# Altium project ArcadeMVD-STM 01-1.5.PrjPCB (part 2 of 2)

## Sheet ArcadeMVD-STM 01-1.5 alternative parts.SchDoc: alternative parts
size A3; DrawnBy: Steve Hodges; DocumentNumber: 2; Revision: 1.5; SheetNumber: 2; SheetTotal: 2
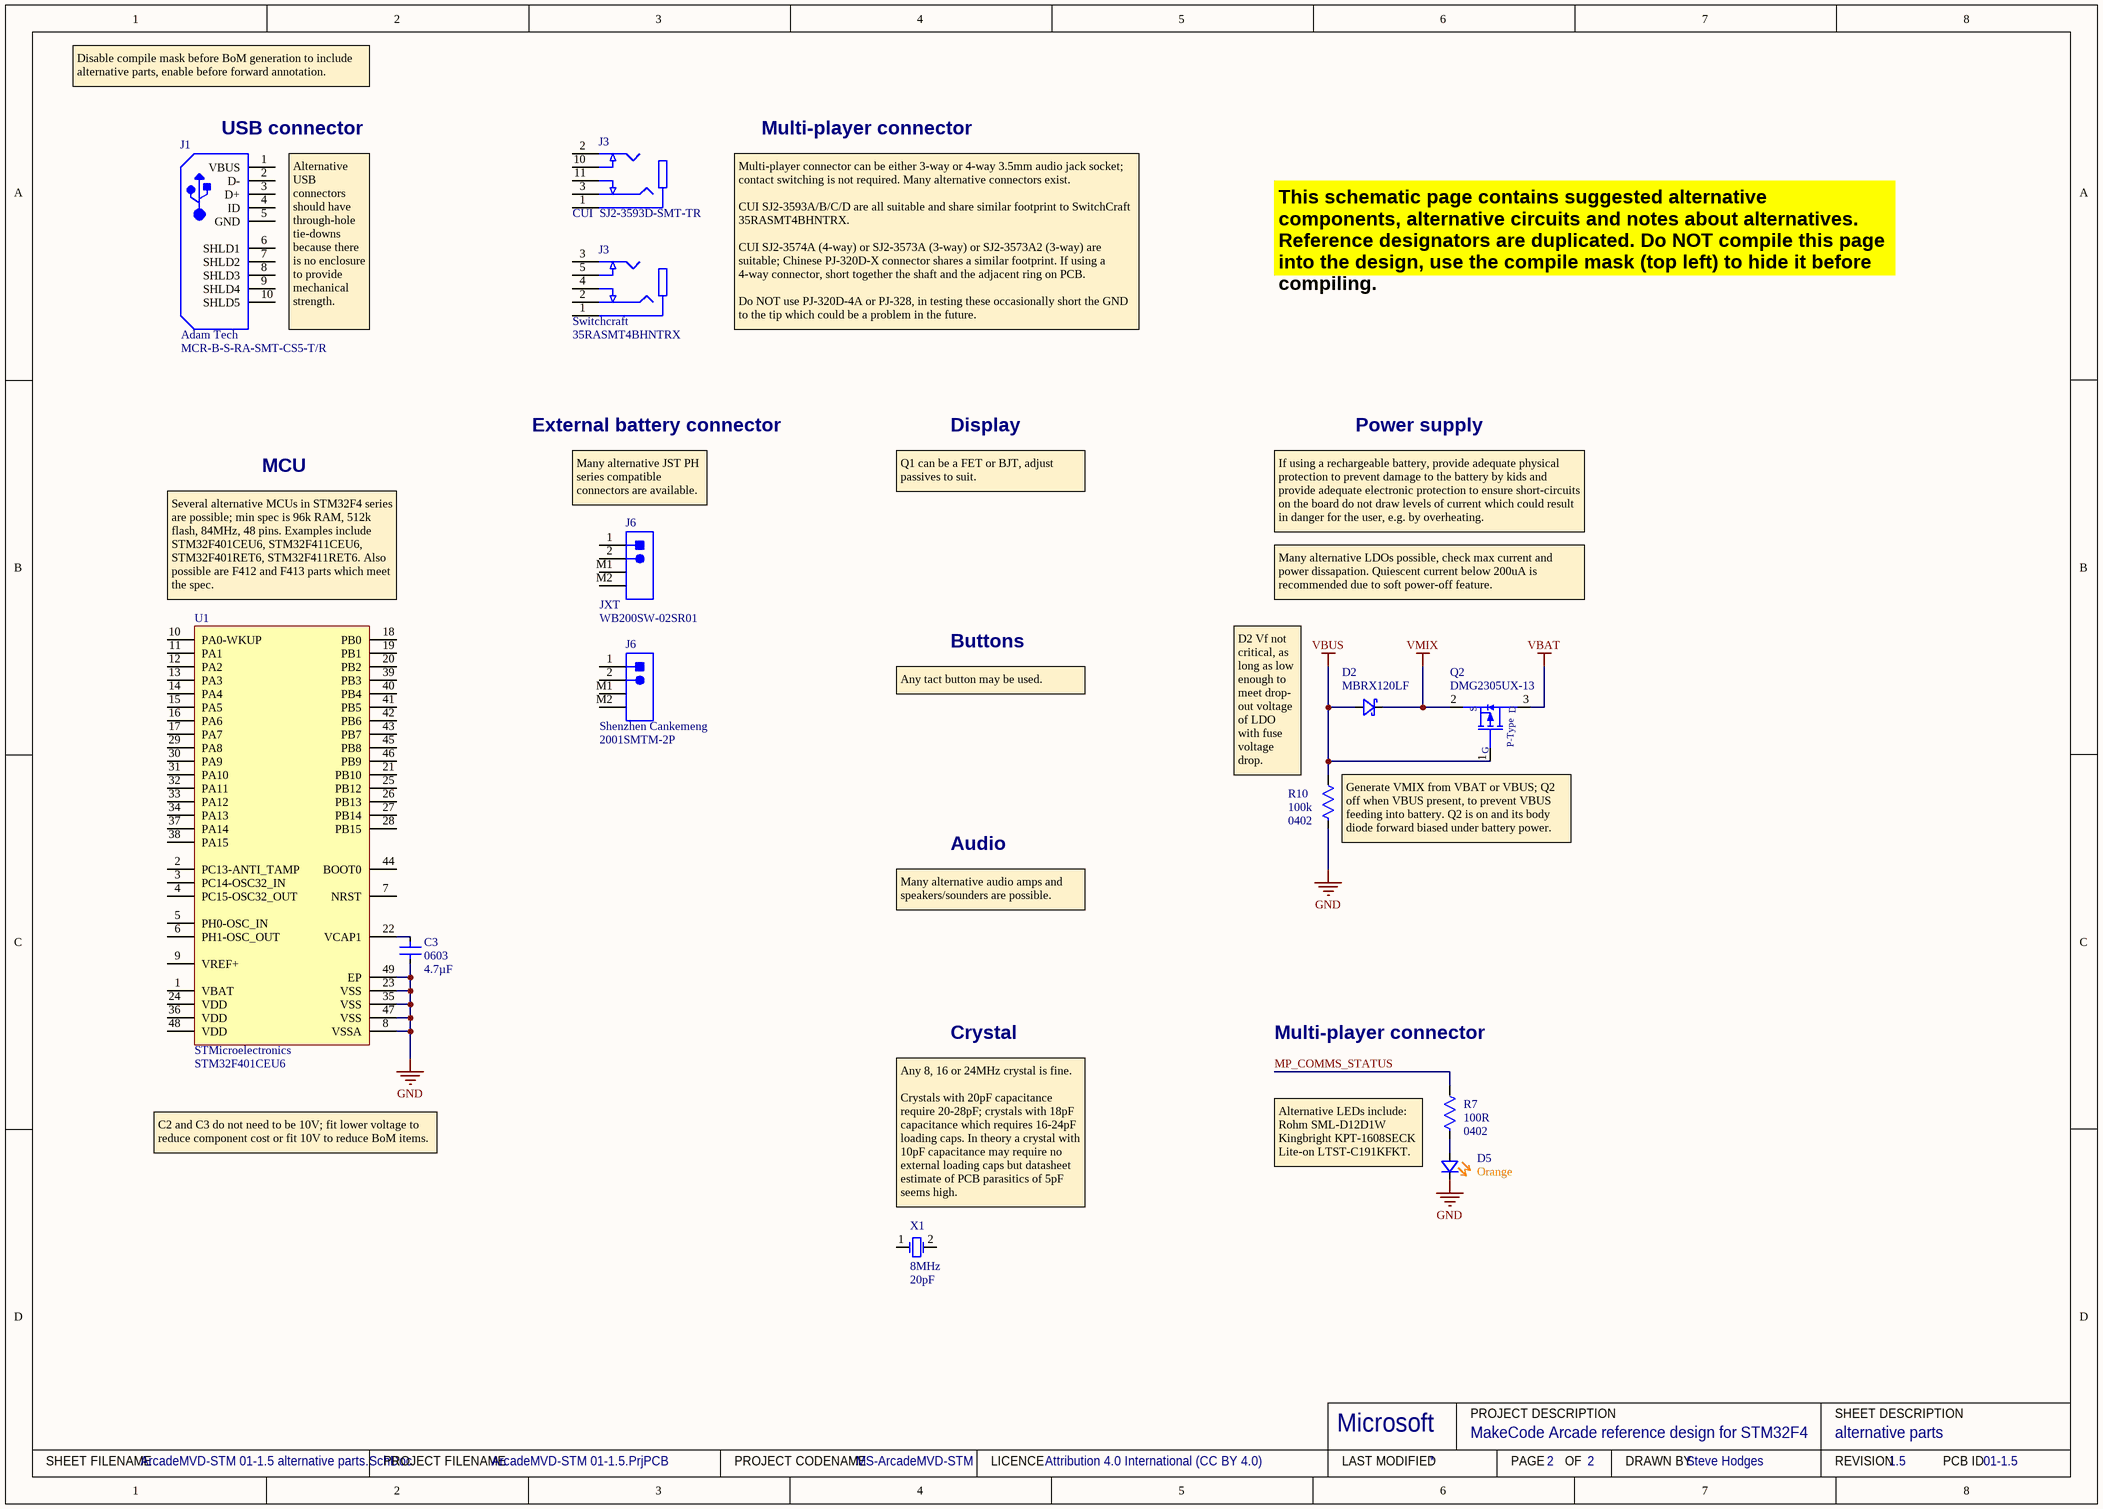
[diagram p1: ArcadeMVD-STM 01-1.5 alternative parts.SchDoc]

### Parts
(Parts that share a designator on the sheet are numbered #1, #2 ... from top to bottom, then left to right.)
C3#2  Case/Package: 0603  Capacitance: 4.7µF  [CAP 0603 (1608) x 1.2mm]  (hidden comment: CL10A475KP8NNNC)  (no BOM)
D2#2  MBRX120LF  [MCC SOD-123]
D5#2  Colour: Orange  [Rohm SML-D12 Orange]  (hidden comment: SML-D12D)  (no BOM)
J1#2  Manufacturer: Adam Tech  [MCR-B-S-RA-SMT-CS5-T/R]  (hidden comment: MCR-B-S-RA-SMT-CS5-T/R)
J3#2  Manufacturer: CUI  Manufacturer Part Number: SJ2-3593D-SMT-TR  [SJ-3593D-SMT-TR]  (hidden comment: SJ2-3593D-SMT)
J3#3  Manufacturer: Switchcraft  [SWIT-35RASMT4BHNTRX_V]  (hidden comment: 35RASMT4BHNTRX)
J6#2  Manufacturer: JXT  [JST- S2B-PH-SM4-TB(LF)(SN)-2_V]  (hidden comment: compatible with S2B-PH-SM4-TB(LF)(SN))
J6#3  Manufacturer: Shenzhen Cankemeng  [JST- S2B-PH-SM4-TB(LF)(SN)-2_V]  (hidden comment: compatible with JST S2B-PH-SM4-TB(LF)(SN))
Q2#2  Manufacturer Part Number: DMG2305UX-13  [DIODES-SOT23-3]  (hidden comment: MOSFET)  (no BOM)
R7#2  value 100R  Case: 0402  [RES0402]  (no BOM)
R10#2  value 100k  Case: 0402  [RES0402]  (hidden comment: RES0402_GENERIC 100k)  (no BOM)
U1#2  Manufacturer: STMicroelectronics  Manufacturer Part Number: STM32F401CEU6  [ST UFQFPN48 SEH]  (hidden comment: ST STM32F401CEU6)
X1#2  Frequency: 8MHz  Load Capacitance: 20pF  [FOX-HC49SDLF_V]  (hidden comment: HX49 SMT xtal 8MHz 20pF)

### Nets
GND: C3#2.1 D5#2.1(K) R10#2.2 U1#2.8(VSSA) U1#2.23(VSS) U1#2.35(VSS) U1#2.47(VSS) U1#2.49(EP)
VBAT: Q2#2.3(D)
VBUS: D2#2.2(A) Q2#2.1(G) R10#2.1
VMIX: D2#2.1(K) Q2#2.2(S)
MP_COMMS_STATUS: R7#2.1
NetC3#2_2: C3#2.2 U1#2.22(VCAP1)
NetD5#2_2: D5#2.2(A) R7#2.2

Not connected (* = marked no-connect by the designer): J1#2 1(VBUS) 2(D-) 3(D+) 4(ID) 5(GND) 6(SHLD1) 7(SHLD2) 8(SHLD3) 9(SHLD4) 10(SHLD5); J3#2 1 2 3 10 11; J3#3 1 2 3 4 5; J6#2 1 2 M1 M2; J6#3 1 2 M1 M2; U1#2 1(VBAT) 2(PC13-ANTI_TAMP) 3(PC14-OSC32_IN) 4(PC15-OSC32_OUT) 5(PH0-OSC_IN) 6(PH1-OSC_OUT) 7(NRST) 9(VREF+) 10(PA0-WKUP) 11(PA1) 12(PA2) 13(PA3) 14(PA4) 15(PA5) 16(PA6) 17(PA7) 18(PB0) 19(PB1) 20(PB2) 21(PB10) 24(VDD) 25(PB12) 26(PB13) 27(PB14) 28(PB15) 29(PA8) 30(PA9) 31(PA10) 32(PA11) 33(PA12) 34(PA13) 36(VDD) 37(PA14) 38(PA15) 39(PB3) 40(PB4) 41(PB5) 42(PB6) 43(PB7) 44(BOOT0) 45(PB8) 46(PB9) 48(VDD); X1#2 1 2

### Notes on the sheet
- Disable compile mask before BoM generation to include alternative parts, enable before forward annotation.
- (near J1#2) USB connector
- Multi-player connector
- This schematic page contains suggested alternative components, alternative circuits and notes about alternatives. Reference designators are duplicated. Do NOT compile this page into the design, use the compile mask (top left) to hide it before compiling.
- (near J1#2) Alternative USB connectors should have through-hole tie-downs because there is no enclosure to provide mechanical strength.
- Multi-player connector can be either 3-way or 4-way 3.5mm audio jack socket; contact switching is not required. Many alternative connectors exist.
  CUI SJ2-3593A/B/C/D are all suitable and share similar footprint to SwitchCraft 35RASMT4BHNTRX.
  CUI SJ2-3574A (4-way) or SJ2-3573A (3-way) or SJ2-3573A2 (3-way) are suitable; Chinese PJ-320D-X connector shares a similar footprint. If using a 4-way connector, short together the shaft and the adjacent ring on PCB.
  Do NOT use PJ-320D-4A or PJ-328, in testing these occasionally short the GND to the tip which could be a problem in the future.
- External battery connector
- Display
- Power supply
- MCU
- (near J6#2) Many alternative JST PH series compatible connectors are available.
- Q1 can be a FET or BJT, adjust passives to suit.
- If using a rechargeable battery, provide adequate physical protection to prevent damage to the battery by kids and provide adequate electronic protection to ensure short-circuits on the board do not draw levels of current which could result in danger for the user, e.g. by overheating.
- (near U1#2) Several alternative MCUs in STM32F4 series are possible; min spec is 96k RAM, 512k flash, 84MHz, 48 pins. Examples include STM32F401CEU6, STM32F411CEU6, STM32F401RET6, STM32F411RET6. Also possible are F412 and F413 parts which meet the spec.
- Buttons
- Many alternative LDOs possible, check max current and power dissapation. Quiescent current below 200uA is recommended due to soft power-off feature.
- Any tact button may be used.
- (near R10#2) D2 Vf not critical, as long as low enough to meet drop- out voltage of LDO with fuse voltage drop.
- Audio
- (near R10#2) Generate VMIX from VBAT or VBUS; Q2 off when VBUS present, to prevent VBUS feeding into battery. Q2 is on and its body diode forward biased under battery power.
- Many alternative audio amps and speakers/sounders are possible.
- Crystal
- (near R7#2) Multi-player connector
- C2 and C3 do not need to be 10V; fit lower voltage to reduce component cost or fit 10V to reduce BoM items.
- Alternative LEDs include:
  Rohm SML-D12D1W
  Kingbright KPT-1608SECK
  Lite-on LTST-C191KFKT.
- (near X1#2) Any 8, 16 or 24MHz crystal is fine.
  Crystals with 20pF capacitance require 20-28pF; crystals with 18pF capacitance which requires 16-24pF loading caps. In theory a crystal with 10pF capacitance may require no external loading caps but datasheet estimate of PCB parasitics of 5pF seems high.
- Microsoft
- PROJECT DESCRIPTION
- SHEET DESCRIPTION
- SHEET FILENAME
- PROJECT FILENAME
- PROJECT CODENAME
- LICENCE
- LAST MODIFIED
- PAGE
- OF
- DRAWN BY
- REVISION
- PCB ID
- (in symbol DMG2305UX-whitesch) P-Type

### Library data of the parts
C3#2 = 4.7uF 10V X5R ±10% Samsung CL: CAP 4.7uF / 10V 0603 SMD; Dielectric: X5R; Tolerance: 10%; Created By: shodges; Supplier 1: Digi-Key; Manufacturer: Samsung; Manufacturer Part Number: CL10A475KP8NNNC; Stock 1: 40000; Pricing 1: 1=0.15, 10=0.109, 100=0.0513, 500=0.036, 1000=0.0298 (USD); Mount: Surface Mount; Case Code (Imperial): 0603; Contact Plating: Tin; Min Operating Temperature: -55°C; Max Operating Temperature: 85°C; Package Quantity: 1; Packaging: Tape and Reel; Length: 1.6mm; Height: 0.8mm; Width: 0.031inch; Thickness: 0.035inch; Depth: 0.8mm; Radiation Hardening: No; Supplier Part Number 1: 1276-1044-1-ND; Supplier 2: Farnell; Supplier Part Number 2: 3010071; Case Code (Metric): 1608; Voltage Rating: 10V
D2#2 = MCC MBRX120LF: Schottky diode, 1A low Vf; Manufacturer: MCC; Manufacturer Part Number: MBRX120LF-TP; Forward Voltage: 360mV; Max Repetitive Reverse Voltage (Vrrm): 20V; Max Forward Surge Current (Ifsm): 12A; Element Configuration: Single; Max Power Dissipation: 556mW; Supplier 1: Digi-Key; Stock 1: 67630; Pricing 1: 1=0.51, 10=0.362, 100=0.2379, 500=0.1406, 1000=0.10815 (USD); Mount: Surface Mount; Number of Pins: 2; Min Operating Temperature: -65°C; Max Operating Temperature: 125°C; Packaging: Tape and Reel; Package Quantity: 1; Average Rectified Current: 1A; Forward Current: 1A; Peak Non-Repetitive Surge Current: 12A; Max Reverse Voltage (DC): 20V; Max Surge Current: 12A; Radiation Hardening: No; Lead Free: Lead Free; REACH SVHC: Unknown; Supplier 2: Farnell; Supplier 3: Mouser; ComponentLink1Description: MCC datasheet; ComponentLink1URL: http://www.mccsemi.com/up_pdf/MBRX120LF(SOD-123).pdf; Supplier Part Number 3: 833-MBRX120LF-TP; Supplier Part Number 1: MBRX120LF-TPMSCT-ND; Supplier Part Number 2: 1924371
D5#2 = SML-D12D: 1.6 x 0.8 x 0.55mm (0603) LED 605nm Orange; Manufacturer: Rohm Semiconductor; Manufacturer Part Number: SML-D12D8WT86; Millicandela Rating: 100mcd; Voltage - Forward (Vf) (Typ): 2.2V; Current - Test: 20mA; Lens Type: Diffused, White; Lens Style/Size: Rectangle with Flat Top, 1.2mm x 0.8mm; Supplier 1: Digi-Key; RoHS: RoHS Compliant; Category: Optoelectronics; Stock 1: 1719; Pricing 1: 1=0.38, 10=0.279, 25=0.2232, 100=0.1478, 250=0.1046, 500=0.08926, 1000=0.06974 (GBP); Packaging: Cut Tape (CT); Wavelength - Dominant: 605nm; Wavelength - Peak: -; Viewing Angle: -; Package / Case: 0603 (1608 Metric); Size / Dimension: 1.60mm L x 0.80mm W; Height: 0.55mm; Mounting Type: Surface Mount; Luminous Flux @ Current - Test: -; ComponentLink1URL: http://rohmfs.rohm.com/en/products/databook/datasheet/opto/led/chip_mono/sml-d1.pdf; ComponentLink1Description: http://rohmfs.rohm.com/en/products/databook/datasheet/opto/led/chip_mono/sml-d1.pdf; Supplier Part Number 1: 511-1577-1-ND
J1#2 = MCR-B-S-RA-SMT-CS5-T/R-whitesch: USB micro B with TH anchors; Supplier Part Number 1: MCR-B-S-RA-SMT-CS5-T/R; Supplier 1: Adam Tech; Manufacturer Part Number: MCR-B-S-RA-SMT-CS5-T/R
J3#2 = SJ2-3593D-SMT: 3-way 3.5mm switched jack socket SMD R/A; Number of Conductors: 3; Number of Ports: 1; Shielding: Unshielded; Stock 1: 1306; Pricing 1: 1=1.32, 10=1.158, 25=1.0904, 50=1.0448, 100=0.9995, 250=0.9086, 500=0.81774 (USD); Color: Black; Connector Type: Jack; Orientation: Horizontal; Supplier 2: Mouser; Supplier 1: Digikey; Supplier Part Number 1: CP-SJ2-3593D-SMT-CT-ND; Supplier Part Number 2: 490-SJ2-3593D-SMT-TR; ComponentLink1Description: CUI datasheet; ComponentLink1URL: https://www.cui.com/product/resource/sj2-359x-smt.pdf
J3#3 = 35RASMT4BHNTRX: 3-way 3.5mm switched jack socket SMD R/A; Gender: Female; Shielding: Unshielded; Number of Ports: 1; Voltage Rating: 250V; Current Rating: 3A; Supplier 1: Digi-Key; Stock 1: 27420; Pricing 1: 1=1.01, 10=0.933, 25=0.8792, 50=0.8528, 100=0.8127, 250=0.79944, 500=0.78376 (USD); Mount: Surface Mount; Contact Plating: Silver; Color: Black; Contact Material: Copper Alloy; Number of Terminals: 5; Housing Color: Black; Housing Material: Thermoplastic; Min Operating Temperature: -25°C; Max Operating Temperature: 85°C; Packaging: Tape and Reel; Termination: Solder; Package Quantity: 1100; Max Current Rating: 3A; Orientation: Right Angle; Length: 19mm; Depth: 6mm; Lead Free: Lead Free; ComponentLink1URL: http://www.switchcraft.com/Drawings/35rasmt4bhntrx_cd.pdf?src-supplier=Digi-Key; ComponentLink1Description: Switchcraft datasheet online; Supplier 2: Farnell; Supplier 3: Mouser; Supplier 4: RSComponents; Supplier Part Number 1: SC1488-1-ND; Supplier Part Number 2: 2914546; Supplier Part Number 3: 502-35RASMT4BHNTRX; Supplier Part Number 4: 7051490; ComponentLink3Description: Switchcraft datasheet; ComponentLink3URL: Y:\System\Altium\Libraries 2014\Switchcraft\Datasheets\35rasmt4bhntrx_cd.pdf; Manufacturer Part Number: 35RASMT4BHNTRX
J6#2 = WB200SW-02SR01: Male header, pitch 2 mm, 1x2 position; Number of Poles: 2; Connector Type: Male Pin; Pitch: 2mm; Width: 2.34 mm; ComponentLink1Description: JST connector selector website; ComponentLink2Description: JST datasheet; ComponentLink1URL: http://www.jst.com/home2.html; ComponentLink2URL: http://www.jst-mfg.com/product/pdf/eng/ePH.pdf; Height: 8.13 mm; PackageDescription: Male Header, Pitch 2 mm, 1 x 2 Position, Height 5.5 mm; Color: Natural,White; Housing Color: Beige; Number of Rows: 1; Number of Positions: 2; Termination: Solder; Orientation: Right Angle; Gender: Male; Fastening Type: Detent; Number of Contacts: 2; Depth: 7.6mm; Manufacturer Part Number: WB200SW-02SR01
J6#3 = 2001SMTM-2P: Male header, pitch 2 mm, 1x2 position; Number of Poles: 2; Connector Type: Male Pin; Pitch: 2mm; Width: 2.34 mm; ComponentLink1Description: JST connector selector website; ComponentLink2Description: JST datasheet; ComponentLink1URL: http://www.jst.com/home2.html; ComponentLink2URL: http://www.jst-mfg.com/product/pdf/eng/ePH.pdf; Height: 8.13 mm; PackageDescription: Male Header, Pitch 2 mm, 1 x 2 Position, Height 5.5 mm; Color: Natural,White; Housing Color: Beige; Number of Rows: 1; Number of Positions: 2; Termination: Solder; Orientation: Right Angle; Gender: Male; Fastening Type: Detent; Number of Contacts: 2; Depth: 7.6mm; ComponentLink3Description: Shenzhen Cankemeng datasheet online; ComponentLink3URL: https://datasheet.lcsc.com/szlcsc/Shenzhen-Cankemeng-2001series-socket-1-2P-2mm_C132500.pdf; ComponentLink4Description: Shenzhen Cankemeng datahsheet; ComponentLink4URL: y:\System\Altium\Libraries 2014\Shenzhen Cankemeng\Datasheets\Shenzhen-Cankemeng-2001series-socket-1-2P-2mm_C132500.pdf; ComponentLink5Description: Shenzhen Cankemeng website; ComponentLink5URL: http://www.ckmtw.com.cn/; Manufacturer Part Number: 2001SMTM-2P; Pricing 1: 10=0.06, 100=0.047, 1000=0.042; Supplier 1: LCSC; Supplier Part Number 1: C132500
Q2#2 = DMG2305UX-whitesch: MOSFET P-CH 20V 4.2A SOT23; Manufacturer: Diodes; Rise Time: 13.7ns; Rds On Max: 52mR; Input Capacitance: 808pF; Max Power Dissipation: 1.4W; Turn-On Delay Time: 10.8ns; Turn-Off Delay Time: 79.3ns; Fall Time: 34.7ns; Threshold Voltage: -900mV; Element Configuration: Single; Gate to Source Voltage (Vgs): 8V; Number of Channels: 1; Drain to Source Breakdown Voltage: -20V; On-State Resistance: 65MR; Supplier 1: Digi-Key; Stock 1: 131638; Pricing 1: 1=0.44, 10=0.398, 100=0.2228, 500=0.1194, 1000=0.0812 (USD); Mount: Surface Mount; Case/Package: TO-236-3; Number of Pins: 3; Weight: 0.000282oz; Min Operating Temperature: -55°C; Max Operating Temperature: 150°C; Package Quantity: 1; Packaging: Tape and Reel; Continuous Drain Current (ID): 4.2A; Drain to Source Voltage (Vdss): 20V; Drain to Source Resistance: 52mR; Length: 3mm; Height: 1.1mm; Width: 1.4mm; Radiation Hardening: No; REACH SVHC: No SVHC; Lead Free: Lead Free; ComponentLink2URL: https://datasheet.ciiva.com/18566/dmg2305ux-18566951.pdf; ComponentLink2Description: online datasheet; Supplier Part Number 1: DMG2305UX-13DICT-ND; ComponentLink3Description: datasheet; ComponentLink3URL: Y:\System\Altium\Libraries 2014\Diodes Inc\Datasheets\dmg2305ux-30023840.pdf; Supplier 2: Farnell; Supplier 3: Mouser; Supplier 4: RSComponents; Supplier Part Number 2: 2543533; Supplier Part Number 3: 621-DMG2305UX-7; Supplier Part Number 4: 8270452
R7#2 = RES0402_GENERIC: Generic 0402 Chip Resistor
R10#2 = RES0402_GENERIC: Generic 0402 Chip Resistor 100k
U1#2 = ST STM32F401CEU6: ARM Cortex M4 MCU+FPU 512k Flash, 96k RAM, 84MHz, QFPN48; Min Supply Voltage: 1.7V; Max Supply Voltage: 3.6V; RAM Size: 96KB; Max Power Dissipation: 625mW; Interface: I2C,SPI,USB,IrDA,SDIO,UART,USART,LIN,I2S; Number of I/Os: 36; Number of Timers/Counters: 8; Oscillator Type: Internal; Data Bus Width: 32b; Watchdog Timer: Yes; Memory Size: 512KB; Number of ADC Channels: 10; Peripherals: Brown-out Detect/Reset,POR,PWM,WDT,DMA; Operating Supply Voltage: 3.3V; ComponentLink1Description: ST datasheet; ComponentLink1URL: https://www.st.com/resource/en/datasheet/stm32f411vc.pdf; Supplier 1: Digi-Key; Stock 1: 1989; Pricing 1: 1=6.42, 10=5.764, 260=4.48069, 520=4.02052, 1040=3.3908 (USD); Mount: Surface Mount; Case/Package: UFQFPN; Number of Pins: 48; Contact Plating: Tin,Matte; Min Operating Temperature: -40°C; Max Operating Temperature: 85°C; Packaging: Tray; Frequency: 84MHz; Number of Programmable I/O: 36; Max Frequency: 84MHz; Memory Type: FLASH; Package Quantity: 1560; Core Architecture: ARM; Radiation Hardening: No; REACH SVHC: No SVHC; Lead Free: Lead Free; Supplier 2: Farnell; Supplier 3: Mouser; Supplier Part Number 1: 497-17427-ND; Supplier Part Number 2: 2432105; Supplier Part Number 3: 511-STM32F401CEU6
X1#2 = FOXSDLF/080-20: 13.9x5mm SMD Crystal; Manufacturer: Fox Electronics; Frequency Tolerance: 30ppm; ESR (Equivalent Series Resistance): 80R; Tolerance: 50ppm; Supplier 1: Digi-Key; Stock 1: 0; Mount: Surface Mount; Case/Package: SMD/SMT; Number of Pins: 2; Min Operating Temperature: -20°C; Max Operating Temperature: 70°C; Packaging: Tape and Reel; Package Quantity: 1000; Frequency Stability: 50ppm; Termination: SMD/SMT; Series Resistance: 80R; Length: 11.7mm; Height: 0.177inch; Width: 0.197inch; Depth: 5mm; Radiation Hardening: No; REACH SVHC: No SVHC; Lead Free: Lead Free; ComponentLink2URL: http://www.farnell.com/datasheets/1911271.pdf?src-supplier=Element14; ComponentLink2Description: Fox datasheet (old version hosted by Farnell); ComponentLink3URL: https://www.verical.com/server-webapp/html/getDatasheet?partID=563510&src-supplier=Verical; ComponentLink3Description: Fox datasheet (old version hosted by Verical); Supplier 2: Farnell; Supplier 3: RSComponents; Supplier 4: Mouser; Supplier Part Number 1: 631-1010-1-ND; Supplier Part Number 2: 2063972; Supplier Part Number 3: 5476452; Supplier Part Number 4: 559-FOXSD080-20-LF; ComponentLink4Description: Fox datasheet (new version); ComponentLink4URL: http://www.foxonline.com/pdfs/C4SD.pdf; Manufacturer Part Number: FOXSDLF/080-20

## Nets that join several sheets
GND: ArcadeMVD-STM 01-1.5 complete design (54 pins), ArcadeMVD-STM 01-1.5 alternative parts (8 pins)
VBAT: ArcadeMVD-STM 01-1.5 complete design (J5.4 J6#1.1 Q2#1.3), ArcadeMVD-STM 01-1.5 alternative parts (Q2#2.3)
VBUS: ArcadeMVD-STM 01-1.5 complete design (7 pins), ArcadeMVD-STM 01-1.5 alternative parts (D2#2.2 Q2#2.1 R10#2.1)
VMIX: ArcadeMVD-STM 01-1.5 complete design (D2#1.1 F1.2 J5.2 Q2#1.2), ArcadeMVD-STM 01-1.5 alternative parts (D2#2.1 Q2#2.2)
MP_COMMS_STATUS: ArcadeMVD-STM 01-1.5 complete design (R7#1.1 U1#1.27), ArcadeMVD-STM 01-1.5 alternative parts (R7#2.1)